# EAGLE design octoscroller (EAGLE 6.5.0)
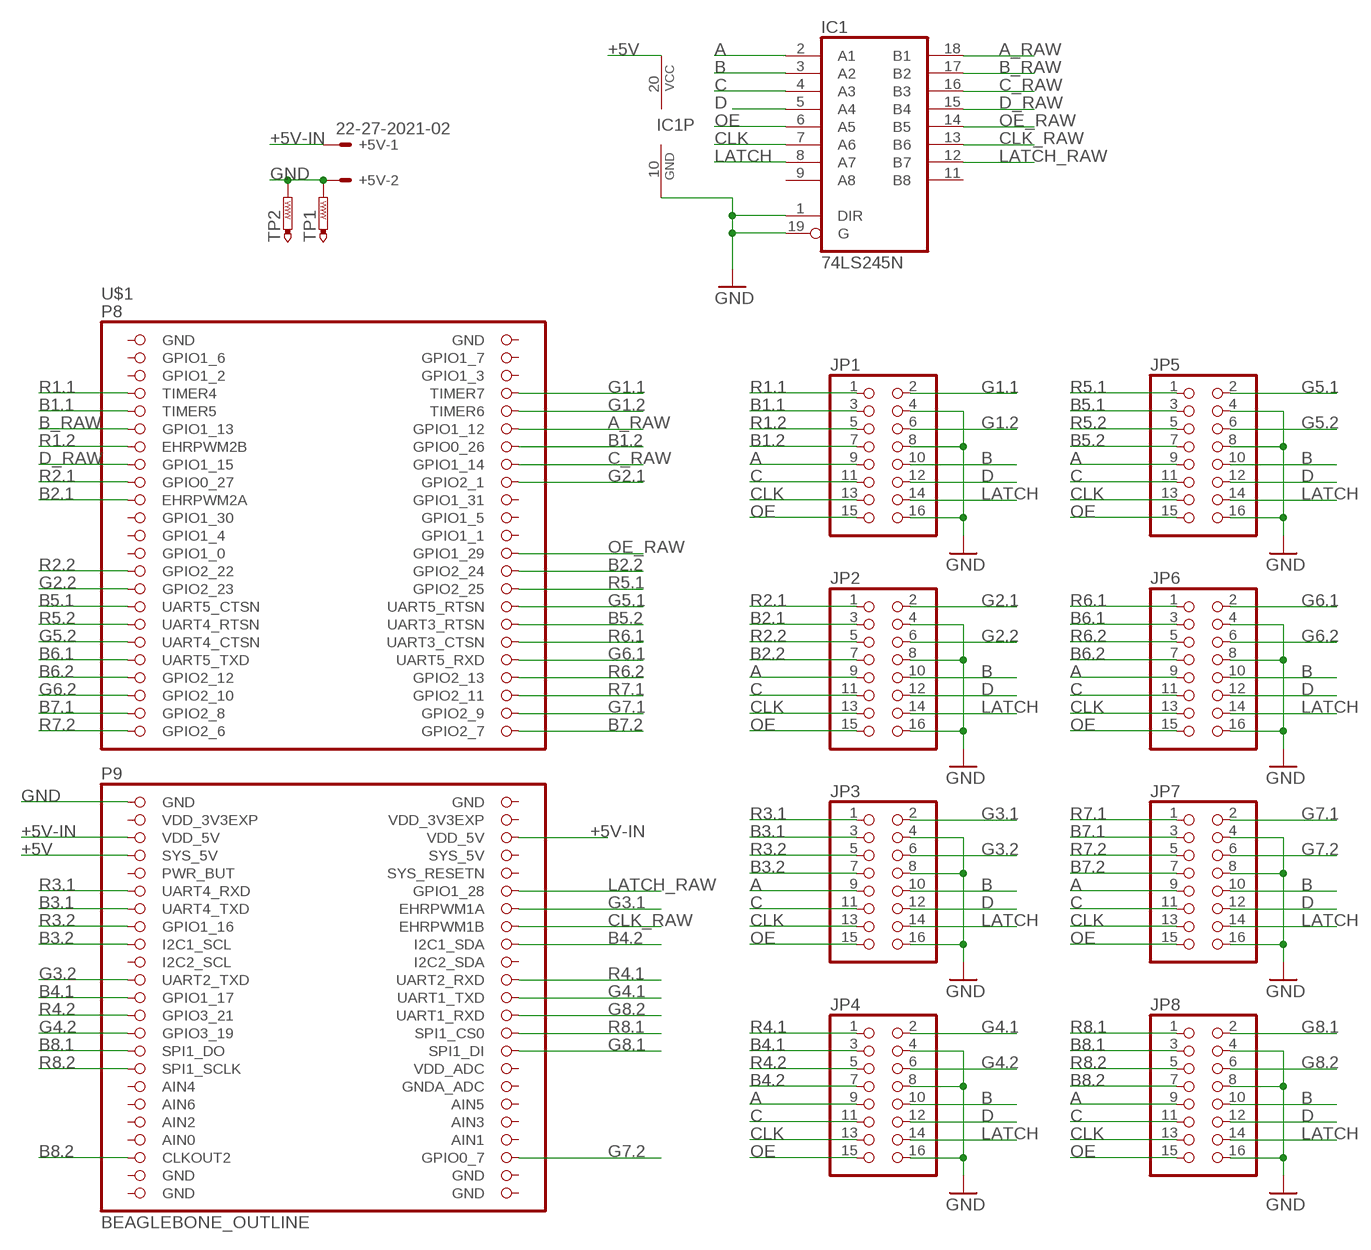
[diagram p0: schematic, sheet 1]

## Parts
+5V  22-27-2021-02  [6410-02]
IC1  74LS245N  [DIL20]
JP1  PINHD-2X8  [2X08]
JP2  PINHD-2X8  [2X08]
JP3  PINHD-2X8  [2X08]
JP4  PINHD-2X8  [2X08]
JP5  PINHD-2X8  [2X08]
JP6  PINHD-2X8  [2X08]
JP7  PINHD-2X8  [2X08]
JP8  PINHD-2X8  [2X08]
TP1  PTR1PAD1-13  [P1-13]
TP2  PTR1PAD1-13  [P1-13]
U$1  BEAGLEBONE_OUTLINE  [BEAGLEBONE_SHIELD]

## Nets
+5V: IC1.20(VCC) U$1.53(SYS_5V)
+5V-IN: +5V.1 U$1.51(VDD_5V) U$1.52(VDD_5V)
A: IC1.2(A1) JP1.9 JP2.9 JP3.9 JP4.9 JP5.9 JP6.9 JP7.9 JP8.9
A_RAW: IC1.18(B1) U$1.12(GPIO1_12)
B: IC1.3(A2) JP1.10 JP2.10 JP3.10 JP4.10 JP5.10 JP6.10 JP7.10 JP8.10
B1.1: JP1.3 U$1.9(TIMER5)
B1.2: JP1.7 U$1.14(GPIO0_26)
B2.1: JP2.3 U$1.19(EHRPWM2A)
B2.2: JP2.7 U$1.28(GPIO2_24)
B3.1: JP3.3 U$1.59(UART4_TXD)
B3.2: JP3.7 U$1.63(I2C1_SCL)
B4.1: JP4.3 U$1.69(GPIO1_17)
B4.2: JP4.7 U$1.64(I2C1_SDA)
B5.1: JP5.3 U$1.31(UART5_CTSN)
B5.2: JP5.7 U$1.34(UART3_RTSN)
B6.1: JP6.3 U$1.37(UART5_TXD)
B6.2: JP6.7 U$1.39(GPIO2_12)
B7.1: JP7.3 U$1.43(GPIO2_8)
B7.2: JP7.7 U$1.46(GPIO2_7)
B8.1: JP8.3 U$1.75(SPI1_DO)
B8.2: JP8.7 U$1.87(CLKOUT2)
B_RAW: IC1.17(B2) U$1.11(GPIO1_13)
C: IC1.4(A3) JP1.11 JP2.11 JP3.11 JP4.11 JP5.11 JP6.11 JP7.11 JP8.11
C_RAW: IC1.16(B3) U$1.16(GPIO1_14)
CLK: IC1.7(A6) JP1.13 JP2.13 JP3.13 JP4.13 JP5.13 JP6.13 JP7.13 JP8.13
CLK_RAW: IC1.13(B6) U$1.62(EHRPWM1B)
D: IC1.5(A4) JP1.12 JP2.12 JP3.12 JP4.12 JP5.12 JP6.12 JP7.12 JP8.12
D_RAW: IC1.15(B4) U$1.15(GPIO1_15)
G1.1: JP1.2 U$1.8(TIMER7)
G1.2: JP1.6 U$1.10(TIMER6)
G2.1: JP2.2 U$1.18(GPIO2_1)
G2.2: JP2.6 U$1.29(GPIO2_23)
G3.1: JP3.2 U$1.60(EHRPWM1A)
G3.2: JP3.6 U$1.67(UART2_TXD)
G4.1: JP4.2 U$1.70(UART1_TXD)
G4.2: JP4.6 U$1.73(GPIO3_19)
G5.1: JP5.2 U$1.32(UART5_RTSN)
G5.2: JP5.6 U$1.35(UART4_CTSN)
G6.1: JP6.2 U$1.38(UART5_RXD)
G6.2: JP6.6 U$1.41(GPIO2_10)
G7.1: JP7.2 U$1.44(GPIO2_9)
G7.2: JP7.6 U$1.88(GPIO0_7)
G8.1: JP8.2 U$1.76(SPI1_DI)
G8.2: JP8.6 U$1.72(UART1_RXD)
GND: +5V.2 IC1.1(DIR) IC1.10(GND) IC1.19(G) JP1.4 JP1.8 JP1.16 JP2.4 JP2.8 JP2.16 JP3.4 JP3.8 JP3.16 JP4.4 JP4.8 JP4.16 JP5.4 JP5.8 JP5.16 JP6.4 JP6.8 JP6.16 JP7.4 JP7.8 JP7.16 JP8.4 JP8.8 JP8.16 TP1.TP TP2.TP U$1.47(GND)
LATCH: IC1.8(A7) JP1.14 JP2.14 JP3.14 JP4.14 JP5.14 JP6.14 JP7.14 JP8.14
LATCH_RAW: IC1.12(B7) U$1.58(GPIO1_28)
OE: IC1.6(A5) JP1.15 JP2.15 JP3.15 JP4.15 JP5.15 JP6.15 JP7.15 JP8.15
OE_RAW: IC1.14(B5) U$1.26(GPIO1_29)
R1.1: JP1.1 U$1.7(TIMER4)
R1.2: JP1.5 U$1.13(EHRPWM2B)
R2.1: JP2.1 U$1.17(GPIO0_27)
R2.2: JP2.5 U$1.27(GPIO2_22)
R3.1: JP3.1 U$1.57(UART4_RXD)
R3.2: JP3.5 U$1.61(GPIO1_16)
R4.1: JP4.1 U$1.68(UART2_RXD)
R4.2: JP4.5 U$1.71(GPIO3_21)
R5.1: JP5.1 U$1.30(GPIO2_25)
R5.2: JP5.5 U$1.33(UART4_RTSN)
R6.1: JP6.1 U$1.36(UART3_CTSN)
R6.2: JP6.5 U$1.40(GPIO2_13)
R7.1: JP7.1 U$1.42(GPIO2_11)
R7.2: JP7.5 U$1.45(GPIO2_6)
R8.1: JP8.1 U$1.74(SPI1_CS0)
R8.2: JP8.5 U$1.77(SPI1_SCLK)
Unconnected: IC1.9(A8) IC1.11(B8) U$1.3(GPIO1_6) U$1.4(GPIO1_7) U$1.5(GPIO1_2) U$1.6(GPIO1_3) U$1.20(GPIO1_31) U$1.21(GPIO1_30) U$1.22(GPIO1_5) U$1.23(GPIO1_4) U$1.24(GPIO1_1) U$1.25(GPIO1_0) U$1.54(SYS_5V) U$1.55(PWR_BUT) U$1.56(SYS_RESETN) U$1.65(I2C2_SCL) U$1.66(I2C2_SDA) U$1.78(VDD_ADC) U$1.79(AIN4) U$1.80(GNDA_ADC) U$1.81(AIN6) U$1.82(AIN5) U$1.83(AIN2) U$1.84(AIN3) U$1.86(AIN1)

## Power pins joined to a net without a drawn wire
AIN0: U$1.85(AIN0)
GND: U$1.1(GND) U$1.2(GND) U$1.48(GND) U$1.89(GND) U$1.90(GND) U$1.91(GND) U$1.92(GND)
VDD_3V3EXP: U$1.49(VDD_3V3EXP) U$1.50(VDD_3V3EXP)

## Library data of the parts
+5V = con-molex:22-?-02: CONNECTOR wire to board 2.54 mm (.1 inch) pitch header; OC_FARNELL: unknown; OC_NEWARK: unknown
IC1 = adafruit:74*245: Octal BUS TRANSCEIVER, 3-state
JP1-JP8 = pinhead:PINHD-2X8: PIN HEADER
TP1 TP2 = testpad:PTR1: TEST PIN
U$1 = adafruit:BEAGLEBONE_OUTLINE: Should match A3 pinout - but not completely tested

## Net classes
0 default: width 0.254 mm

## Board
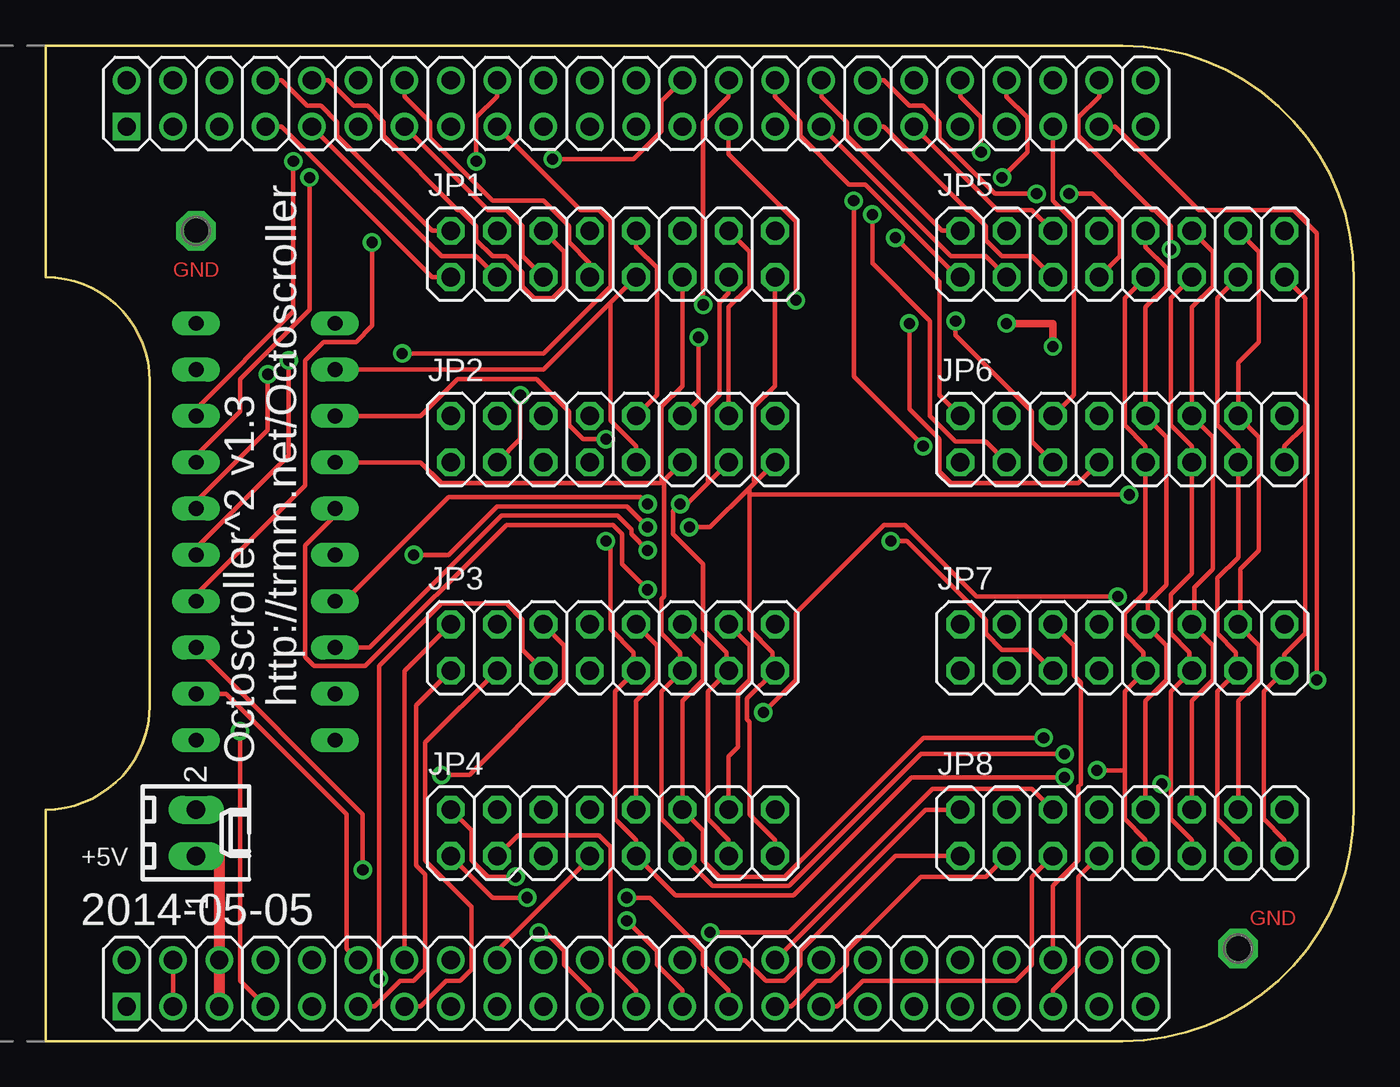
[diagram p1: board, top side]
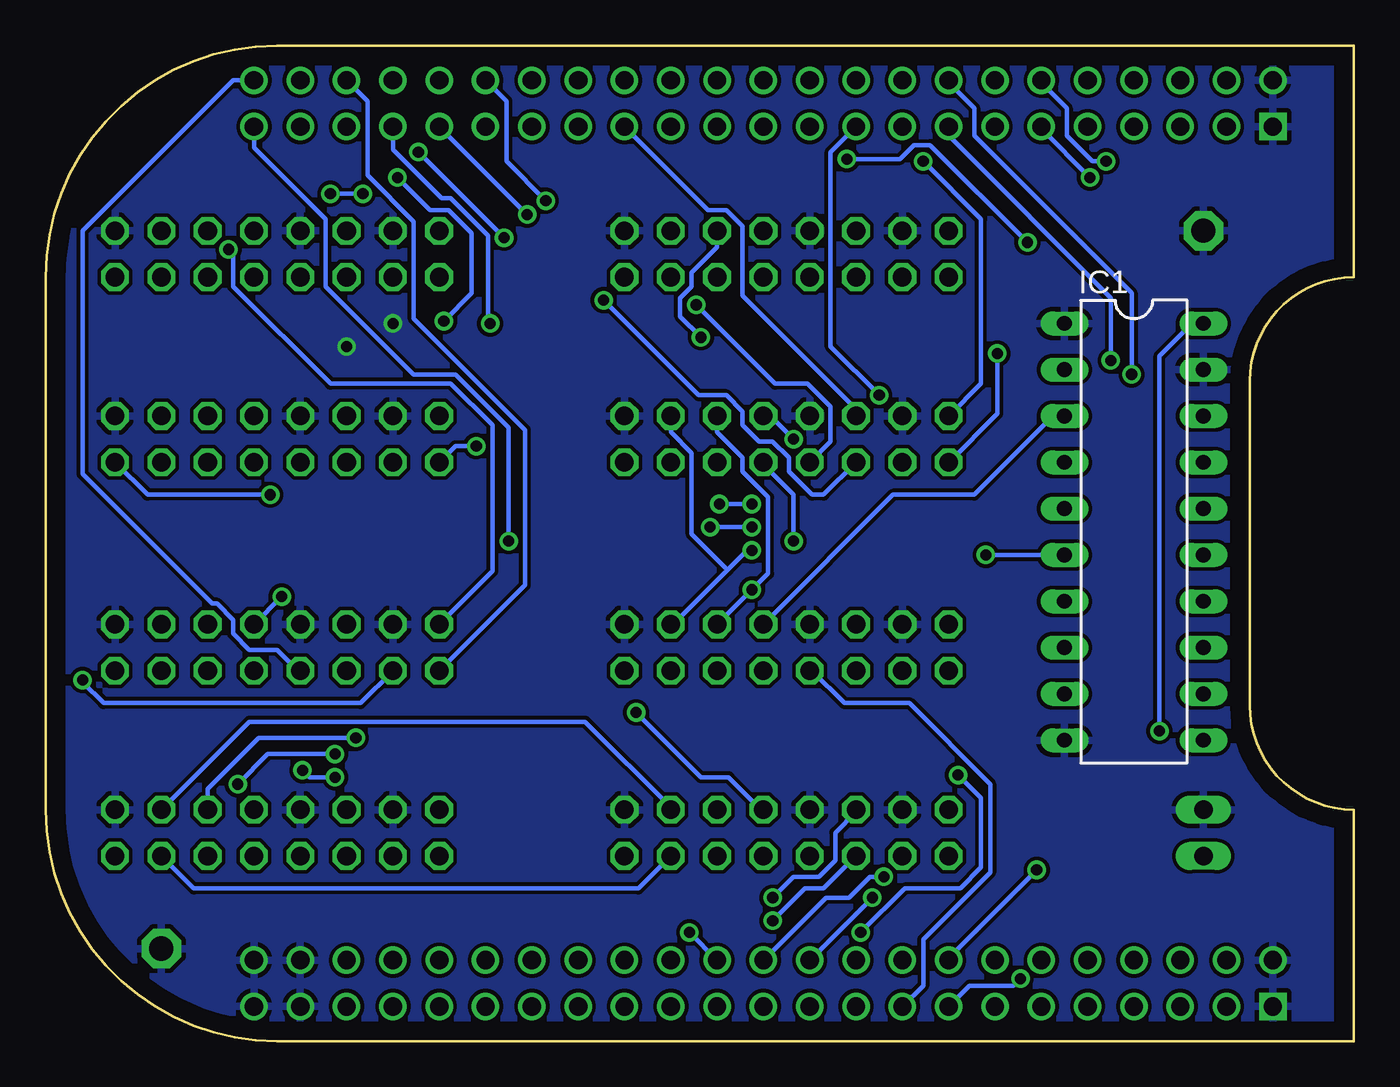
[diagram p2: board, bottom side, seen from below]

Size 71.76 x 54.61 mm. Coordinates in mm from the lower left corner, seen from the top.
Copper layers (1*16): Top 0.035mm / dielectric 1.5mm / Bottom 0.035mm
Design rules "default": minimum track width 10mil, minimum drill 24mil, track to track 8mil, track to pad 8mil, pad to pad 8mil, via to via 8mil, smd to smd 8mil, copper to edge 40mil, drill to drill 8mil, minimum pad ring 10mil, minimum via ring 8mil, stop-mask expansion 4mil, vias tented up to drill 0mil, thermal gap 10mil

### Footprints (pad centres in the part's own frame; a part is rotated, then mirrored left to right if it is on the bottom)
6410-02 = drill 1.016 long: 1 1.27,0; 2 -1.27,0
DIL20 = drill 0.813 long: 1 -11.43,-3.81; 2 -8.89,-3.81; 3 -6.35,-3.81; 4 -3.81,-3.81; 5 -1.27,-3.81; 6 1.27,-3.81; 7 3.81,-3.81; 8 6.35,-3.81; 9 8.89,-3.81; 10 11.43,-3.81; 11 11.43,3.81; 12 8.89,3.81; 13 6.35,3.81; 14 3.81,3.81; 15 1.27,3.81; 16 -1.27,3.81; 17 -3.81,3.81; 18 -6.35,3.81; 19 -8.89,3.81; 20 -11.43,3.81
2X08 = drill 1.016 octagon: 1 -8.89,-1.27; 2 -8.89,1.27; 3 -6.35,-1.27; 4 -6.35,1.27; 5 -3.81,-1.27; 6 -3.81,1.27; 7 -1.27,-1.27; 8 -1.27,1.27; 9 1.27,-1.27; 10 1.27,1.27; 11 3.81,-1.27; 12 3.81,1.27; 13 6.35,-1.27; 14 6.35,1.27; 15 8.89,-1.27; 16 8.89,1.27
P1-13 = drill 1.321 pad 2.159 octagon: TP 0,0
BEAGLEBONE_SHIELD = drill 1 square: 1 4.445,19.05; 47 52.705,19.05 | drill 1: 2 1.905,19.05; 3 4.445,21.59; 4 1.905,21.59; 5 4.445,24.13; 6 1.905,24.13; 7 4.445,26.67; 8 1.905,26.67; 9 4.445,29.21; 10 1.905,29.21; 11 4.445,31.75; 12 1.905,31.75; 13 4.445,34.29; 14 1.905,34.29; 15 4.445,36.83; 16 1.905,36.83; 17 4.445,39.37; 18 1.905,39.37; 19 4.445,41.91; 20 1.905,41.91; 21 4.445,44.45; 22 1.905,44.45; 23 4.445,46.99; 24 1.905,46.99; 25 4.445,49.53; 26 1.905,49.53; 27 4.445,52.07; 28 1.905,52.07; 29 4.445,54.61; 30 1.905,54.61; 31 4.445,57.15; 32 1.905,57.15; 33 4.445,59.69; 34 1.905,59.69; 35 4.445,62.23; 36 1.905,62.23; 37 4.445,64.77; 38 1.905,64.77; 39 4.445,67.31; 40 1.905,67.31; 41 4.445,69.85; 42 1.905,69.85; 43 4.445,72.39; 44 1.905,72.39; 45 4.445,74.93; 46 1.905,74.93; 48 50.165,19.05; 49 52.705,21.59; 50 50.165,21.59; 51 52.705,24.13; 52 50.165,24.13; 53 52.705,26.67; 54 50.165,26.67; 55 52.705,29.21; 56 50.165,29.21; 57 52.705,31.75; 58 50.165,31.75; 59 52.705,34.29; 60 50.165,34.29; 61 52.705,36.83; 62 50.165,36.83; 63 52.705,39.37; 64 50.165,39.37; 65 52.705,41.91; 66 50.165,41.91; 67 52.705,44.45; 68 50.165,44.45; 69 52.705,46.99; 70 50.165,46.99; 71 52.705,49.53; 72 50.165,49.53; 73 52.705,52.07; 74 50.165,52.07; 75 52.705,54.61; 76 50.165,54.61; 77 52.705,57.15; 78 50.165,57.15; 79 52.705,59.69; 80 50.165,59.69; 81 52.705,62.23; 82 50.165,62.23; 83 52.705,64.77; 84 50.165,64.77; 85 52.705,67.31; 86 50.165,67.31; 87 52.705,69.85; 88 50.165,69.85; 89 52.705,72.39; 90 50.165,72.39; 91 52.705,74.93; 92 50.165,74.93

### Placement (x,y rotation side)
+5V  8.25,11.43 270 top
IC1  12.07,27.94 270 bottom
JP1  31.11,43.18 0 top
JP2  31.11,33.02 0 top
JP3  31.11,21.59 0 top
JP4  31.11,11.43 0 top
JP5  59.06,43.18 0 top
JP6  59.06,33.02 0 top
JP7  59.06,21.59 0 top
JP8  59.06,11.43 0 top
TP1  8.25,44.45 0 top
TP2  65.41,5.08 0 top
U$1  -14.61,54.61 270 top

### Tracks (layer width: path | path; a pad name or v marks a point on that pad's centre or on a via)
+5V  (via drill 0.61)
  Top 0.254: v10.67,17.02 10.67,3.3 U$1.53
  Bottom 0.254: IC1.20 8.89,39.37 10.67,37.59 v10.67,17.02
+5V-IN
  Top 0.61: +5V.1 9.53,10.16 U$1.52 U$1.51
A  (via drill 0.61)
  Top 0.254: JP8.9 60.33,11.05 59.18,12.19 59.18,14.86 | 59.18,14.86 59.18,19.18 JP7.9 60.2,20.32 60.2,21.34 59.18,22.35 59.18,23.5 60.33,24.64 JP6.9 60.33,32.64 59.18,33.78 59.18,40.77 JP5.9 | IC1.2 27.31,36.83 30.92,40.45 | JP1.9 30.92,40.45 | JP2.9 32.39,32.64 30.99,34.04 30.99,40.39 30.92,40.45 | v30.73,27.43 30.99,27.18 30.99,22.61 32.26,21.34 32.26,20.32 JP3.9 31.24,19.18 31.24,12.19 32.39,11.05 JP4.9 34.54,8 41.02,8 47.5,14.48 v55.88,14.48 | v57.66,14.86 59.18,14.86
  Bottom 0.254: v30.73,27.43 30.73,29.97 32.39,31.62 JP2.9 | v57.66,14.86 57.28,14.48 v55.88,14.48
A_RAW  (via drill 0.61)
  Top 0.254: IC1.18 8.25,34.67 13.59,40.01 v13.59,48.26
  Bottom 0.254: v13.59,48.26 14.35,48.26 15.75,49.66 15.75,51.18 17.14,52.58 U$1.12
B  (via drill 0.61)
  Top 0.254: JP8.10 60.33,18.67 61.47,19.81 61.47,21.72 JP7.10 60.45,22.86 60.45,24 61.47,25.02 61.47,33.15 JP6.10 60.33,40.26 61.47,41.4 61.47,42.42 60.33,43.56 JP5.10 | JP4.10 32.39,18.67 33.53,19.81 33.53,21.72 JP3.10 | IC1.3 20.57,34.29 22.61,36.32 26.92,36.32 28.7,34.54 28.7,33.78 29.46,33.02 v30.73,33.02 | JP1.10 32.39,43.56 33.53,42.42 33.53,35.43 JP2.10 | v58.8,24.38 51.05,24.38 47.12,28.32 45.97,28.32 41.15,23.5 41.15,19.81 v39.37,18.03
  Bottom 0.254: v30.73,33.02 32,34.29 JP2.10 | JP3.10 25.27,29.97 20.83,29.97 16.51,34.29 IC1.3 | v58.8,24.38 JP7.10 | v39.37,18.03 35.81,14.48 34.29,14.48 32.51,12.7 JP4.10
B1.1
  Top 0.254: U$1.9 21.72,43.05 23.62,43.05 JP1.3
B1.2
  Top 0.254: U$1.14 19.68,51.82 21.08,50.42 21.08,49.53 24.51,46.1 27.31,46.1 28.7,44.7 28.7,43.82 29.85,42.67 JP1.7
B2.1  (via drill 0.61)
  Top 0.254: v26.04,35.43 26.04,33.02 JP2.3
  Bottom 0.254: U$1.19 28.7,48.77 28.7,38.1 v26.04,35.43
B2.2  (via drill 0.61)
  Top 0.254: U$1.28 37.47,51.82 36.07,50.42 v36.07,40.39
  Bottom 0.254: v36.07,40.39 31.75,36.07 29.97,36.07 28.7,34.8 28.7,32.89 JP2.7
B3.1
  Top 0.254: U$1.59 20.57,1.91 21.97,3.3 22.73,3.3 23.37,3.94 23.37,7.37 20.83,9.91 20.83,16.38 JP3.3
B3.2
  Bottom 0.254: U$1.63 23.62,3.05 23.62,5.59 19.94,9.27 19.94,14.1 24.38,18.54 27.94,18.54 29.72,20.32 JP3.7
B4.1
  Top 0.254: U$1.69 32.39,2.79 30.99,4.19 30.99,10.67 30.35,11.3 25.91,11.3 JP4.3
B4.2
  Top 0.254: U$1.64 24.76,4.95 29.85,10.03 JP4.7
B5.1
  Top 0.254: U$1.31 49.66,43.05 51.56,43.05 JP5.3
B5.2  (via drill 0.61)
  Top 0.254: U$1.34 45.97,52.7 47.37,51.31 48.13,51.31 49.02,50.42 49.02,49.53 52.07,46.48 v54.36,46.48 | v56.13,46.48 57.4,46.48 58.93,44.96 58.93,43.05 JP5.7
  Bottom 0.254: v56.13,46.48 v54.36,46.48
B6.1  (via drill 0.61)
  Top 0.254: v45.34,45.34 45.34,42.67 48.51,39.5 48.51,34.29 49.91,32.89 51.56,32.89 JP6.3
  Bottom 0.254: v45.34,45.34 U$1.37
B6.2  (via drill 0.61)
  Top 0.254: v47.37,39.37 47.37,34.67 49.02,33.02 49.02,31.24 49.66,30.61 56.64,30.61 JP6.7
  Bottom 0.254: U$1.39 52.7,48.9 50.04,46.23 49.53,46.23 47.5,44.2 47.5,39.5 v47.37,39.37
B7.1  (via drill 0.61)
  Top 0.254: U$1.43 58.67,50.17 63.25,45.59 68.45,45.59 69.72,44.32 v69.72,19.81
  Bottom 0.254: v69.72,19.81 69.72,19.69 68.58,18.54 54.48,18.54 JP7.3
B7.2
  Bottom 0.254: U$1.46 61.47,52.7 69.72,44.45 69.72,31.12 62.61,24 62.36,24 61.47,23.11 61.47,22.35 60.58,21.46 59.06,21.46 57.91,20.32 JP7.7
B8.1
  Top 0.254: U$1.75 40.89,1.91 42.29,3.3 43.05,3.3 43.94,4.19 43.94,4.95 48.01,9.02 51.56,9.02 JP8.3
B8.2
  Top 0.254: U$1.87 55.25,2.79 56.64,4.19 56.64,9.02 JP8.7
B_RAW  (via drill 0.61)
  Top 0.254: IC1.17 8.25,32.13 10.67,34.54 10.67,36.32 14.48,40.13 v14.48,47.37
  Bottom 0.254: v14.48,47.37 17.14,50.04 U$1.11
C  (via drill 0.61)
  Top 0.254: JP8.11 62.87,11.05 61.72,12.19 61.72,14.1 | 61.72,14.1 61.72,19.18 JP7.11 62.74,20.32 62.74,21.34 61.72,22.35 61.72,24.51 62.87,25.65 JP6.11 62.87,32.64 61.72,33.78 61.72,40.77 JP5.11 | IC1.4 20.57,31.75 21.72,30.61 33.78,30.61 33.84,30.67 | JP2.11 33.84,30.67 | JP1.11 34.92,35.94 33.78,34.8 33.78,30.73 33.84,30.67 | 33.84,30.67 33.91,30.61 33.91,24.38 33.78,24.26 33.78,22.35 34.8,21.34 34.8,20.32 JP3.11 33.78,19.18 33.78,12.19 34.92,11.05 JP4.11 36.58,8.51 40.77,8.51 48.01,15.75 v55.88,15.75 | v61.21,14.1 61.72,14.1
  Bottom 0.254: v61.21,14.1 59.56,15.75 v55.88,15.75
C_RAW  (via drill 0.61)
  Top 0.254: IC1.16 8.25,29.59 12.19,33.53 v12.19,36.58
  Bottom 0.254: v12.19,36.58 12.19,41.02 20.83,49.66 20.83,51.18 22.22,52.58 U$1.16
CLK  (via drill 0.61)
  Top 0.254: JP8.13 65.41,11.05 64.26,12.19 64.26,19.18 JP7.13 65.28,20.32 65.28,21.34 64.26,22.35 64.26,25.4 65.41,26.54 JP6.13 65.41,32.64 64.26,33.78 64.26,40.77 JP5.13 | JP4.13 37.47,11.05 36.32,12.19 36.32,19.18 JP3.13 37.34,20.32 37.34,21.34 36.07,22.61 36.07,26.16 34.42,27.81 34.42,29.08 v34.8,29.46 35.18,29.46 36.39,30.67 | IC1.7 16.38,24.13 22.1,29.85 32.64,29.85 v33.02,29.46 | JP2.13 36.39,30.67 | JP1.13 37.47,41.02 36.96,40.51 36.96,35.43 36.32,34.8 36.32,30.73 36.39,30.67
  Bottom 0.254: v34.8,29.46 v33.02,29.46 | JP8.13 63.63,8.38 39.24,8.38 JP4.13
CLK_RAW  (via drill 0.61)
  Top 0.254: IC1.13 17.4,12.45 v17.4,9.4
  Bottom 0.254: v17.4,9.4 22.22,4.57 U$1.62
D  (via drill 0.61)
  Top 0.254: JP8.12 62.87,18.67 64.01,19.81 64.01,21.72 JP7.12 62.99,22.86 62.99,24.89 64.01,25.91 64.01,33.15 JP6.12 62.87,40.26 64.01,41.4 64.01,43.31 JP5.12 | IC1.5 15.88,28.83 14.22,27.18 14.22,21.08 14.73,20.57 17.53,20.57 25.27,28.32 31.11,28.32 31.62,27.81 31.62,26.16 v33.02,24.77 | JP3.12 36.07,21.72 36.07,19.81 34.92,18.67 JP4.12 36.07,11.56 36.07,9.91 36.96,9.02 40.51,9.02 48.13,16.64 v54.74,16.64 | v35.81,38.61 35.81,35.18 JP2.12
  Bottom 0.254: JP3.12 v33.02,24.77 32.13,25.65 32.13,29.85 33.53,31.24 33.53,32 34.92,33.4 JP2.12 | JP1.12 34.92,43.56 36.32,42.16 36.32,41.4 36.96,40.77 36.96,39.75 v35.81,38.61 | JP8.12 62.87,13.84 60.07,16.64 v54.74,16.64
D_RAW  (via drill 0.61)
  Top 0.254: IC1.15 8.25,27.05 13.34,32.13 v13.34,37.34
  Bottom 0.254: v13.34,37.34 13.34,40.77 22.22,49.66 U$1.15
G1.1
  Top 0.254: U$1.8 12.95,52.7 14.35,51.31 15.11,51.31 16,50.42 16,49.66 21.21,44.45 JP1.2
G1.2
  Top 0.254: U$1.10 15.49,52.7 16.89,51.31 17.65,51.31 18.54,50.42 18.54,49.66 22.61,45.59 22.73,45.59 23.62,44.7 23.62,43.94 24.51,43.05 25.27,43.05 26.16,42.16 26.16,41.4 26.8,40.77 27.81,40.77 28.45,41.4 28.45,43.31 JP1.6
G2.1  (via drill 0.61)
  Top 0.254: U$1.18 24.76,51.82 23.62,50.67 v23.62,48.26
  Bottom 0.254: v23.62,48.26 20.45,45.09 20.45,36.07 JP2.2
G2.2
  Bottom 0.254: U$1.29 35.43,45.59 34.42,45.59 33.53,44.7 33.53,40.89 27.31,34.67 JP2.6
G3.1
  Top 0.254: U$1.60 19.68,20.32 JP3.2
G3.2  (via drill 0.61)
  Top 0.254: U$1.67 29.85,2.79 28.45,4.19 28.45,4.95 27.43,5.97 v27.05,5.97 | v21.72,14.61 23.24,14.61 28.45,19.81 28.45,21.72 JP3.6
  Bottom 0.254: v27.05,5.97 24.64,8.38 21.59,8.38 20.45,9.53 20.45,13.34 v21.72,14.61
G4.1  (via drill 0.61)
  Top 0.254: v25.78,9.02 24.26,9.02 23.37,9.91 23.37,11.56 JP4.2
  Bottom 0.254: U$1.70 28.96,7.87 27.69,7.87 26.54,9.02 v25.78,9.02
G4.2  (via drill 0.61)
  Top 0.254: U$1.73 37.47,2.79 36.07,4.19 36.07,4.95 33.15,7.87 v31.88,7.87
  Bottom 0.254: v31.88,7.87 30.73,9.02 29.34,9.02 28.45,9.91 28.45,11.43 27.31,12.57 JP4.6
G5.1
  Top 0.254: U$1.32 42.55,51.82 43.94,50.42 43.94,49.66 49.15,44.45 JP5.2
G5.2
  Top 0.254: U$1.35 52.2,45.59 54.1,45.59 JP5.6
G6.1  (via drill 0.61)
  Top 0.254: U$1.38 50.17,51.82 51.31,50.67 v51.31,48.77 | v46.61,44.07 49.02,41.66 49.02,35.43 JP6.2
  Bottom 0.254: v46.61,44.07 v51.31,48.77
G6.2
  Top 0.254: U$1.41 55.25,46.1 56.39,44.96 56.39,35.43 JP6.6
G7.1  (via drill 0.61)
  Top 0.254: U$1.44 57.79,51.82 56.64,50.67 56.64,49.66 60.71,45.59 60.83,45.59 61.72,44.7 v61.72,43.43
  Bottom 0.254: v61.72,43.43 61.47,43.18 61.47,41.4 56.13,36.07 49.53,36.07 47.24,33.78 47.24,25.78 JP7.2
G7.2
  Top 0.254: U$1.88 55.25,8.51 56.64,9.91 56.64,13.97 56.77,14.1 56.77,19.69 56.39,20.07 56.39,21.72 JP7.6
G8.1
  Top 0.254: U$1.76 48.26,12.7 JP8.2
G8.2  (via drill 0.61)
  Top 0.254: v36.45,5.97 40.77,5.97 48.64,13.84 54.1,13.84 JP8.6
  Bottom 0.254: v36.45,5.97 U$1.72
GND  (via drill 0.6)
  Top 0.406: v52.7,39.37 55.25,39.37 v55.25,38.1
  pour Bottom: 0.64,54.61 71.76,54.61 71.76,0 0.64,0
LATCH  (via drill 0.61)
  Top 0.254: JP8.14 65.41,18.67 66.55,19.81 66.55,21.72 JP7.14 65.53,22.86 65.53,25.91 66.55,26.92 66.55,33.15 JP6.14 65.41,37.21 66.55,38.35 66.55,43.31 JP5.14 | JP2.14 37.47,40.26 38.61,41.4 38.61,43.31 JP1.14 | IC1.8 17.78,21.59 25.02,28.83 31.37,28.83 32.13,28.07 32.13,27.81 v33.02,26.92 | JP4.14 37.47,15.62 37.97,16.13 37.97,19.18 38.61,19.81 38.61,21.72 JP3.14
  Bottom 0.254: v33.02,26.92 33.27,26.92 34.35,25.84 | 34.35,25.84 37.34,22.86 JP3.14 | JP2.14 37.47,33.4 36.32,32.26 36.32,27.81 34.35,25.84 | JP8.14 60.58,17.53 42.16,17.53 37.47,12.83 JP4.14
LATCH_RAW
  Top 0.254: IC1.12 9.91,19.05 16.51,12.45 16.51,5.08 U$1.58
OE  (via drill 0.61)
  Top 0.254: JP8.15 67.95,11.05 66.8,12.19 66.8,19.18 JP7.15 67.95,21.21 69.09,22.35 69.09,33.66 69.02,33.72 | JP6.15 67.95,32.64 69.02,33.72 | 69.02,33.72 69.09,33.78 69.09,40.77 JP5.15 | JP4.15 40,11.05 38.61,12.45 38.61,17.53 38.48,17.65 38.48,18.8 JP3.15 39.88,20.32 39.88,21.34 38.61,22.61 38.61,29.97 | v20.19,26.67 22.1,26.67 24.76,29.34 31.88,29.34 v33.02,28.19 | v35.31,28.19 36.45,28.19 38.55,30.29 | JP2.15 38.93,30.67 | 38.93,30.67 38.55,30.29 | JP1.15 40,35.94 38.86,34.8 38.86,30.73 38.93,30.67 | 38.61,29.97 38.61,30.23 38.55,30.29 | 38.61,29.97 v59.44,29.97
  Bottom 0.254: v20.19,26.67 IC1.6 | v35.31,28.19 v33.02,28.19 | JP6.15 66.17,29.97 v59.44,29.97
OE_RAW  (via drill 0.61)
  Top 0.254: IC1.14 8.25,24.51 14.22,30.48 14.22,37.34 15.24,38.35 17.02,38.35 17.91,39.24 v17.91,43.82 | v27.81,48.39 32.26,48.39 33.78,49.91 33.78,51.56 U$1.26
  Bottom 0.254: v17.91,43.82 23.24,49.15 24.13,49.15 24.89,48.39 v27.81,48.39
R1.1
  Top 0.254: U$1.7 12.95,50.17 21.21,41.91 JP1.1
R1.2
  Top 0.254: U$1.13 24.26,45.59 25.27,45.59 26.16,44.7 26.16,43.05 JP1.5
R2.1  (via drill 0.61)
  Top 0.254: U$1.17 29.34,45.59 30.35,45.59 30.99,44.96 30.99,41.4 27.31,37.72 v19.56,37.72
  Bottom 0.254: v19.56,37.72 19.56,34.42 JP2.1
R2.2  (via drill 0.61)
  Top 0.254: U$1.27 37.47,48.64 41.15,44.96 v41.15,40.64
  Bottom 0.254: v41.15,40.64 35.94,35.43 34.42,35.43 33.53,34.54 33.53,33.78 32.64,32.89 31.88,32.89 30.99,32 30.99,31.24 29.72,29.97 29.08,29.97 JP2.5
R3.1
  Top 0.254: U$1.57 18.03,1.91 19.43,3.3 20.19,3.3 20.83,3.94 20.83,9.14 20.32,9.65 20.32,18.42 JP3.1
R3.2  (via drill 0.61)
  Top 0.254: v18.29,3.43 18.29,20.57 21.72,24 25.27,24 26.16,23.11 26.16,21.46 JP3.5
  Bottom 0.254: U$1.61 21.08,3.05 18.67,3.05 v18.29,3.43
R4.1  (via drill 0.61)
  Top 0.254: v26.42,7.87 24.51,7.87 JP4.1
  Bottom 0.254: v26.42,7.87 U$1.68
R4.2  (via drill 0.61)
  Top 0.254: U$1.71 34.92,2.79 33.53,4.19 33.53,4.95 v31.88,6.6
  Bottom 0.254: v31.88,6.6 30.1,8.38 29.08,8.38 JP4.5
R5.1
  Top 0.254: U$1.30 40,51.82 41.4,50.42 41.4,49.66 44.07,46.99 44.96,46.99 50.04,41.91 JP5.1
R5.2
  Top 0.254: U$1.33 45.97,50.17 50.55,45.59 50.67,45.59 51.56,44.7 51.56,43.94 52.45,43.05 54.1,43.05 JP5.5
R6.1  (via drill 0.61)
  Top 0.254: v44.32,46.1 44.32,36.45 v48.13,32.64
  Bottom 0.254: U$1.36 46.48,51.56 46.48,48.26 v44.32,46.1 | v48.13,32.64 49.28,32.64 JP6.1
R6.2  (via drill 0.61)
  Top 0.254: U$1.40 52.7,51.82 53.85,50.67 53.85,48.77 v52.45,47.37 | v49.91,39.5 49.91,38.74 54.1,34.54 54.1,32.89 JP6.5
  Bottom 0.254: v52.45,47.37 50.67,45.59 49.66,45.59 48.39,44.32 48.39,41.02 v49.91,39.5
R7.1
  Bottom 0.254: U$1.42 54.1,51.56 54.1,47.5 51.56,44.96 51.56,39.62 45.47,33.53 45.47,25.02 JP7.1
R7.2  (via drill 0.61)
  Top 0.254: v46.36,27.43 47.24,27.43 51.56,23.11 51.56,22.35 52.45,21.46 54.1,21.46 JP7.5
  Bottom 0.254: U$1.45 60.33,49.02 56.39,45.09 56.39,41.4 51.56,36.58 49.28,36.58 46.36,33.66 v46.36,27.43
R8.1
  Top 0.254: U$1.74 38.35,4.45 39.5,3.3 40.51,3.3 41.4,4.19 41.4,4.95 46.61,10.16 JP8.1
R8.2
  Top 0.254: U$1.77 43.43,1.91 44.83,3.3 53.21,3.3 54.1,4.19 54.1,9.02 JP8.5
VDD_3V3EXP
  Top 0.254: U$1.50 U$1.49

### Text on the board
Top: GND | GND
tNames: http://trmm.net/Octoscroller | Octoscroller^2 v1.3 | 2014-05-05